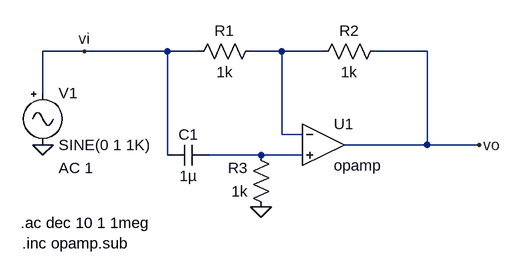
[diagram p0: schematic Pasatodo1erOrden.asc]
Pasatodo1erOrden.asc, the LTspice schematic file:
Version 4
SHEET 1 880 680
WIRE -144 96 -208 96
WIRE -16 96 -144 96
WIRE 32 96 -16 96
WIRE 160 96 112 96
WIRE 224 96 160 96
WIRE 384 96 304 96
WIRE -208 160 -208 96
WIRE 160 224 160 96
WIRE 192 224 160 224
WIRE 384 240 384 96
WIRE 384 240 256 240
WIRE 464 240 384 240
WIRE -16 256 -16 96
WIRE 128 256 48 256
WIRE 192 256 128 256
FLAG 128 336 0
FLAG -144 96 vi
FLAG 464 240 vo
FLAG -208 240 0
SYMBOL res 128 80 R90
WINDOW 0 0 56 VBottom 2
WINDOW 3 32 56 VTop 2
SYMATTR InstName R1
SYMATTR Value 1k
SYMBOL res 320 80 R90
WINDOW 0 0 56 VBottom 2
WINDOW 3 32 56 VTop 2
SYMATTR InstName R2
SYMATTR Value 1k
SYMBOL res 144 352 R180
WINDOW 0 36 76 Left 2
WINDOW 3 36 40 Left 2
SYMATTR InstName R3
SYMATTR Value 1k
SYMBOL cap 48 240 R90
WINDOW 0 0 32 VBottom 2
WINDOW 3 32 32 VTop 2
SYMATTR InstName C1
SYMATTR Value 1µ
SYMBOL OpAmps\\opamp 224 176 R0
SYMATTR InstName U1
SYMBOL Misc\\signal -208 144 R0
WINDOW 123 24 132 Left 2
WINDOW 39 0 0 Left 0
SYMATTR InstName V1
SYMATTR Value2 AC 1
TEXT -242 360 Left 2 !.ac dec 10 1 1meg
TEXT -240 392 Left 2 !.inc opamp.sub

The netlist it stands for:
* Pasatodo1erOrden.asc
R1 N001 vi 1k
R2 vo N001 1k
R3 0 N002 1k
C1 N002 vi 1µ
XU1 N001 N002 vo opamp Aol=100K GBW=10Meg  ; pins invin noninvin out
V1 vi 0 SINE(0 1 1K) AC 1
.ac dec 10 1 1meg
.inc opamp.sub
.backanno
.end